# EAGLE design epiano (EAGLE 9.6.1)
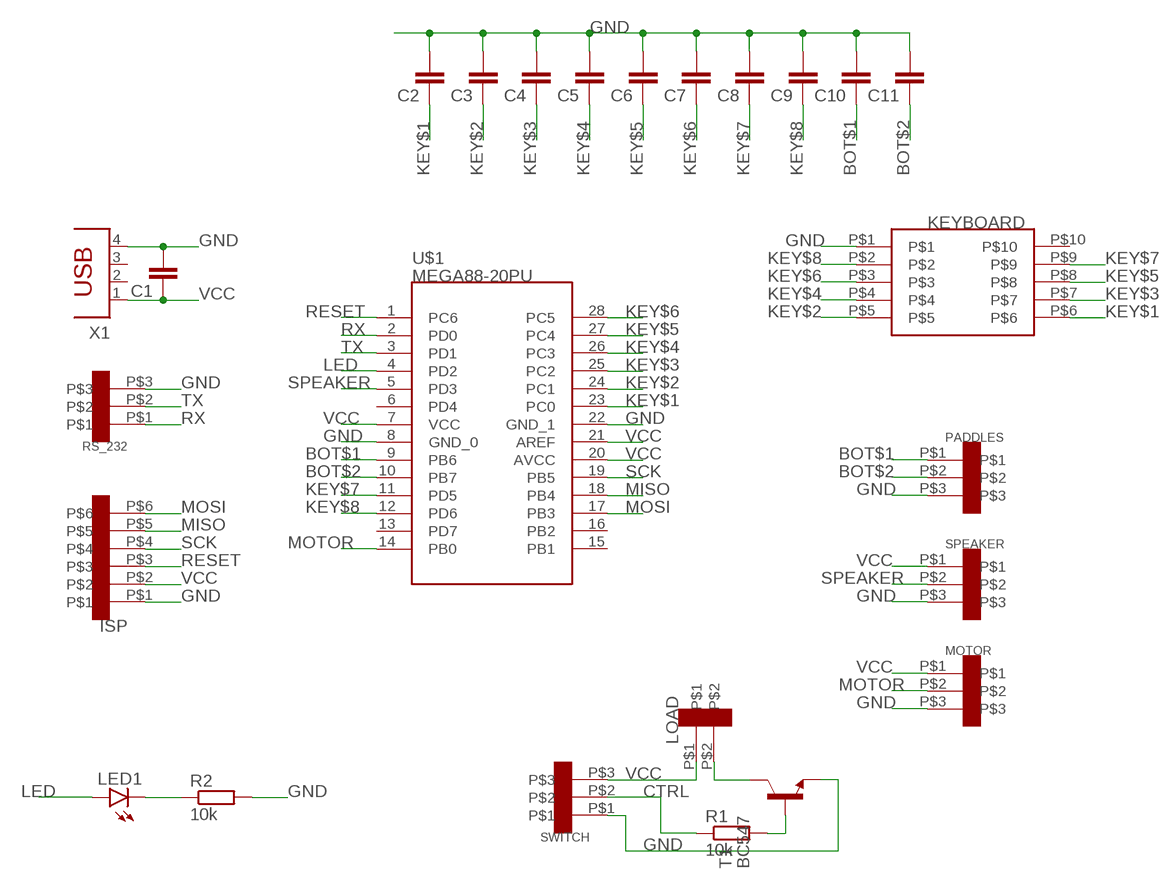
[diagram p0: schematic, sheet 1]

## Parts
C1  C-EU025-060X050  [C025-060X050]
C2  C-EU025-024X044  [C025-024X044]
C3  C-EU025-024X044  [C025-024X044]
C4  C-EU025-024X044  [C025-024X044]
C5  C-EU025-024X044  [C025-024X044]
C6  C-EU025-024X044  [C025-024X044]
C7  C-EU025-024X044  [C025-024X044]
C8  C-EU025-024X044  [C025-024X044]
C9  C-EU025-024X044  [C025-024X044]
C10  C-EU025-024X044  [C025-024X044]
C11  C-EU025-024X044  [C025-024X044]
ISP  CON_DIL_6  [CON_DIL_6]
KEYBOARD  CON_DIL_2X5  [CON_DIL_2X5]
LED1  LED3MM  [LED3MM]
LOAD  CON_DIL_2  [CON_DIL_2]
MOTOR  CON_DIL_3  [CON_DIL_3]
PADDLES  CON_DIL_3  [CON_DIL_3]
R1  10k  R-EU_0204/5  [0204/5]
R2  10k  R-EU_0207/15  [0207/15]
RS_232  CON_DIL_3  [CON_DIL_3]
SPEAKER  CON_DIL_3  [CON_DIL_3]
SWITCH  CON_DIL_3  [CON_DIL_3]
T1  BC547  [TO92]
U$1  MEGA88-20PU  [DIL28-3]
X1  PN87520  [PN87520]

## Nets
BOT$1: C10.1 PADDLES.P$1 U$1.9(PB6)
BOT$2: C11.1 PADDLES.P$2 U$1.10(PB7)
CTRL: R1.1 SWITCH.P$2
GND: C1.2 C2.2 C3.2 C4.2 C5.2 C6.2 C7.2 C8.2 C9.2 C10.2 C11.2 ISP.P$1 KEYBOARD.P$1 MOTOR.P$3 PADDLES.P$3 R2.2 RS_232.P$3 SPEAKER.P$3 SWITCH.P$1 T1.1(E) U$1.8(GND_0) U$1.22(GND_1) X1.4
KEY$1: C2.1 KEYBOARD.P$6 U$1.23(PC0)
KEY$2: C3.1 KEYBOARD.P$5 U$1.24(PC1)
KEY$3: C4.1 KEYBOARD.P$7 U$1.25(PC2)
KEY$4: C5.1 KEYBOARD.P$4 U$1.26(PC3)
KEY$5: C6.1 KEYBOARD.P$8 U$1.27(PC4)
KEY$6: C7.1 KEYBOARD.P$3 U$1.28(PC5)
KEY$7: C8.1 KEYBOARD.P$9 U$1.11(PD5)
KEY$8: C9.1 KEYBOARD.P$2 U$1.12(PD6)
LED: LED1.A U$1.4(PD2)
MISO: ISP.P$5 U$1.18(PB4)
MOSI: ISP.P$6 U$1.17(PB3)
MOTOR: MOTOR.P$2 U$1.14(PB0)
N$1: R1.2 T1.2(B)
N$2: LOAD.P$2 T1.3(C)
N$3: LED1.K(C) R2.1
RESET: ISP.P$3 U$1.1(PC6)
RX: RS_232.P$1 U$1.2(PD0)
SCK: ISP.P$4 U$1.19(PB5)
SPEAKER: SPEAKER.P$2 U$1.5(PD3)
TX: RS_232.P$2 U$1.3(PD1)
VCC: C1.1 ISP.P$2 LOAD.P$1 MOTOR.P$1 SPEAKER.P$1 SWITCH.P$3 U$1.7(VCC) U$1.20(AVCC) U$1.21(AREF) X1.1
Unconnected: KEYBOARD.P$10 U$1.6(PD4) U$1.13(PD7) U$1.15(PB1) U$1.16(PB2) X1.2 X1.3

## Library data of the parts
C1-C11 = rcl:C-EU: CAPACITOR, European symbol
ISP = m_connector:CON_DIL_6
KEYBOARD = connector:CON_DIL_2X5
LED1 = led:LED: LED OSRAM: - CHIPLED LG R971, LG N971, LY N971, LG Q971, LY Q971, LO R971, LY R971 LH N974, LH R974 LS Q976, LO Q976, LY Q976 LO Q996 - Hyper CHIPLED LW Q18S LB Q993, LB Q99A, LB R99A - SideLED LS A670, LO A670, LY A670, LG A670, LP A670 LB A673, LV A673, LT A673, LW A673 LH A674 LY A675 LS A676, LA A676, LO A676, LY A676, LW A676 LS A679, LY A679, LG A679 - Hyper Micro SIDELED® LS Y876, LA Y876, LO Y876, LY Y876 LT Y87S - SmartLED LW L88C, LW L88S LB L89C, LB L89S, LG L890 LS L89K, LO L89K, LY L89K LS L896, LA L896, LO L896, LY L896 - TOPLED LS T670, LO T670, LY T670, LG T670, LP T670 LSG T670, LSP T670, LSY T670, LOP T670, LYG T670 LG T671, LOG T671, LSG T671 LB T673, LV T673, LT T673, LW T673 LH T674 LS T676, LA T676, LO T676, LY T676, LB T676, LH T676, LSB T676, LW T676 LB T67C, LV T67C, LT T67C, LS T67K, LO T67K, LY T67K, LW E67C LS E67B, LA E67B, LO E67B, LY E67B, LB E67C, LV E67C, LT E67C LW T67C LS T679, LY T679, LG T679 LS T770, LO T770, LY T770, LG T770, LP T770 LB T773, LV T773, LT T773, LW T773 LH T774 LS E675, LA E675, LY E675, LS T675 LS T776, LA T776, LO T776, LY T776, LB T776 LHGB T686 LT T68C, LB T68C - Hyper Mini TOPLED® LB M676 - Mini TOPLED Santana® LG M470 LS M47K, LO M47K, LY M47K Source: http://www.osram.convergy.de LUXEON: - LUMILED® LXK2-PW12-R00, LXK2-PW12-S00, LXK2-PW14-U00, LXK2-PW14-V00 LXK2-PM12-R00, LXK2-PM12-S00, LXK2-PM14-U00 LXK2-PE12-Q00, LXK2-PE12-R00, LXK2-PE12-S00, LXK2-PE14-T00, LXK2-PE14-U00 LXK2-PB12-K00, LXK2-PB12-L00, LXK2-PB12-M00, LXK2-PB14-N00, LXK2-PB14-P00, LXK2-PB14-Q00 LXK2-PR12-L00, LXK2-PR12-M00, LXK2-PR14-Q00, LXK2-PR14-R00 LXK2-PD12-Q00, LXK2-PD12-R00, LXK2-PD12-S00 LXK2-PH12-R00, LXK2-PH12-S00 LXK2-PL12-P00, LXK2-PL12-Q00, LXK2-PL12-R00 Source: www.luxeon.com KINGBRIGHT: KA-3528ASYC Source: www.kingbright.com
LOAD = connector:CON_DIL_2
MOTOR PADDLES RS_232 SPEAKER SWITCH = m_connector:CON_DIL_3
R1 R2 = rcl-2:R-EU_: RESISTOR, European symbol
T1 = transistor:BC547: NPN TRANSISTOR
U$1 = m_atmel:MEGA88-20PU
X1 = con-berg:PN87520: BERG USB connector; OC_FARNELL: unknown; OC_NEWARK: unknown

## Board
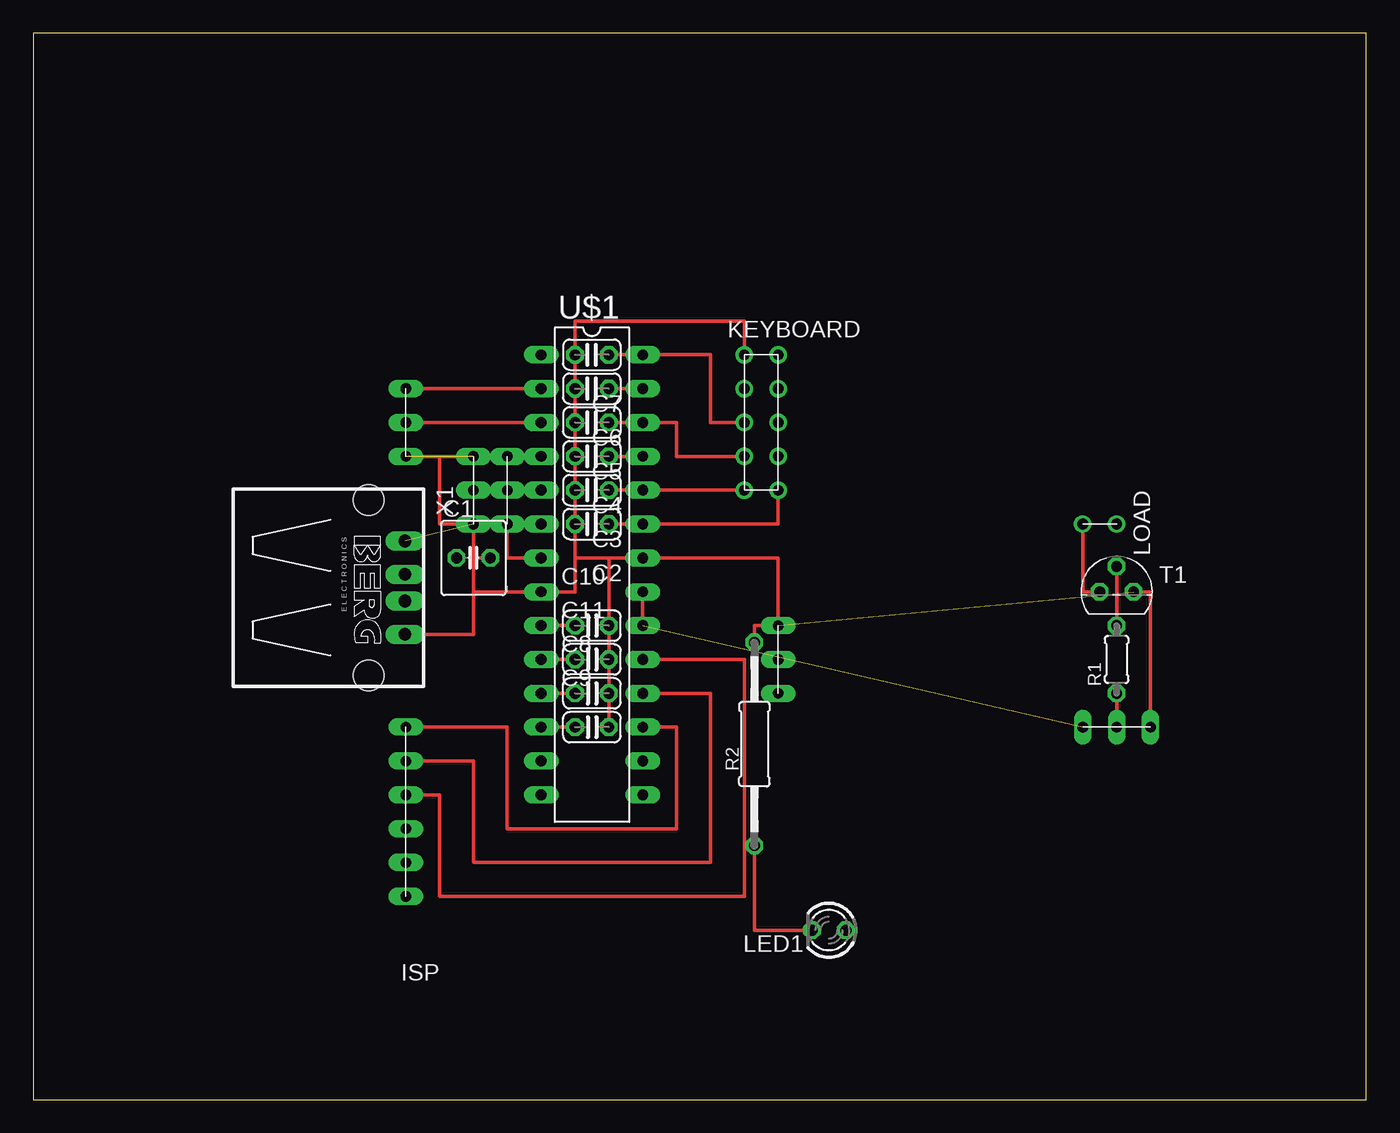
[diagram p1: board, top side]
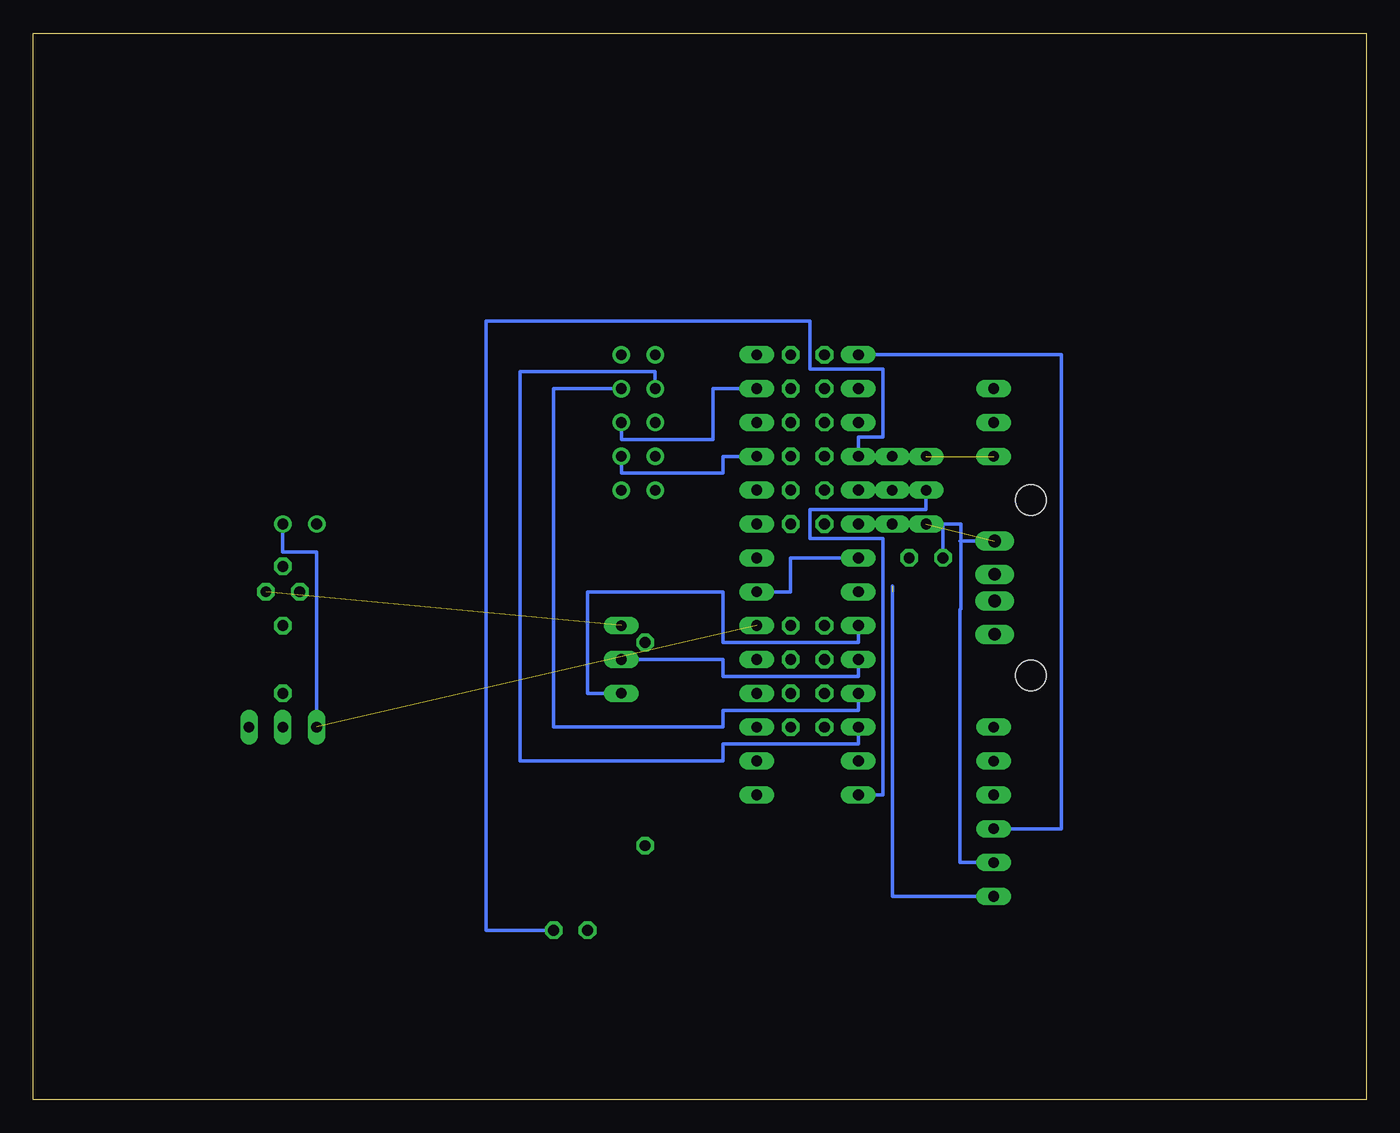
[diagram p2: board, bottom side, seen from below]

Size 100 x 80 mm. Coordinates in mm from the lower left corner, seen from the top.
Outline: 0,0 100,0 100,80 0,80 0,0
Copper layers (1*16): Top 0.035mm / dielectric 1.5mm / Bottom 0.035mm
Design rules "default": minimum track width 10mil, minimum drill 24mil, track to track 8mil, track to pad 8mil, pad to pad 8mil, via to via 8mil, smd to smd 8mil, copper to edge 40mil, drill to drill 8mil, minimum pad ring 10mil, minimum via ring 8mil, stop-mask expansion 4mil, vias tented up to drill 0mil, thermal gap 10mil

### Footprints (pad centres in the part's own frame; a part is rotated, then mirrored left to right if it is on the bottom)
C025-060X050 = drill 0.813 octagon: 1 -1.27,0; 2 1.27,0
C025-024X044 = drill 0.813 octagon: 1 -1.27,0; 2 1.27,0
CON_DIL_6 = drill 0.8 long: P$1 -2.54,5.08; P$2 -2.54,2.54; P$3 -2.54,0; P$4 -2.54,-2.54; P$5 -2.54,-5.08; P$6 -2.54,-7.62
CON_DIL_2X5 = drill 0.8: P$1 -1.27,5.08; P$2 -1.27,2.54; P$3 -1.27,0; P$4 -1.27,-2.54; P$5 -1.27,-5.08; P$6 1.27,-5.08; P$7 1.27,-2.54; P$8 1.27,0; P$9 1.27,2.54; P$10 1.27,5.08
LED3MM = drill 0.813 octagon: A -1.27,0; K 1.27,0
CON_DIL_2 = drill 0.8: P$1 0,2.54; P$2 0,0
CON_DIL_3 = drill 0.8 long: P$1 0,2.54; P$2 0,0; P$3 0,-2.54
0204/5 = drill 0.813 octagon: 1 -2.54,0; 2 2.54,0
0207/15 = drill 0.813 octagon: 1 -7.62,0; 2 7.62,0
TO92 = drill 0.813 octagon: 1 1.27,0; 2 0,1.905; 3 -1.27,0
DIL28-3 = drill 0.813 long: 1 -16.51,-3.81; 2 -13.97,-3.81; 3 -11.43,-3.81; 4 -8.89,-3.81; 5 -6.35,-3.81; 6 -3.81,-3.81; 7 -1.27,-3.81; 8 1.27,-3.81; 9 3.81,-3.81; 10 6.35,-3.81; 11 8.89,-3.81; 12 11.43,-3.81; 13 13.97,-3.81; 14 16.51,-3.81; 15 16.51,3.81; 16 13.97,3.81; 17 11.43,3.81; 18 8.89,3.81; 19 6.35,3.81; 20 3.81,3.81; 21 1.27,3.81; 22 -1.27,3.81; 23 -3.81,3.81; 24 -6.35,3.81; 25 -8.89,3.81; 26 -11.43,3.81; 27 -13.97,3.81; 28 -16.51,3.81
PN87520 = drill 0.95 long: 1 -3.5,2.71; 2 -1,2.71; 3 1,2.71; 4 3.5,2.71 | hole 2.3: -6.57,0; 6.57,0

### Placement (x,y rotation side)
C1  33.02,40.64 0 top
C2  41.91,43.18 180 top
C3  41.91,45.72 180 top
C4  41.91,48.26 180 top
C5  41.91,50.8 180 top
C6  41.91,53.34 180 top
C7  41.91,55.88 180 top
C8  41.91,30.48 0 top
C9  41.91,27.94 0 top
C10  41.91,35.56 0 top
C11  41.91,33.02 0 top
ISP  25.4,20.32 180 top
KEYBOARD  54.61,50.8 0 top
LED1  59.69,12.7 180 top
LOAD  78.74,43.18 270 top
MOTOR  33.02,45.72 180 top
PADDLES  55.88,33.02 180 top
R1  81.28,33.02 90 top
R2  54.1,26.67 90 top
RS_232  27.94,50.8 0 top
SPEAKER  35.56,45.72 180 top
SWITCH  81.28,27.94 270 top
T1  81.28,38.1 0 top
U$1  41.91,39.37 270 top
X1  25.17,38.4 270 top

### Tracks (layer width: path | path; a pad name or v marks a point on that pad's centre or on a via)
BOT$1
  Top 0.254: C10.1 U$1.9
  Bottom 0.254: PADDLES.P$1 58.42,30.48 58.42,38.1 48.26,38.1 48.26,34.29 38.1,34.29 U$1.9
BOT$2
  Top 0.254: C11.1 U$1.10
  Bottom 0.254: PADDLES.P$2 48.26,33.02 48.26,31.75 38.1,31.75 U$1.10
CTRL
  Top 0.254: SWITCH.P$2 R1.1
GND  (3 unrouted)
  Top 0.254: C5.2 C3.2 | C3.2 C2.2 40.64,40.64 | 40.64,40.64 43.18,40.64 | 43.18,40.64 U$1.22 55.88,40.64 PADDLES.P$3 54.1,35.56 R2.2 | 40.64,40.64 40.64,38.1 U$1.8 | C9.2 C8.2 C11.2 C10.2 43.18,40.64 | RS_232.P$3 30.48,48.26 | 30.48,48.26 30.48,43.18 33.02,43.18 33.02,40.64 | 33.02,40.64 33.02,38.1 | U$1.8 33.02,38.1 | KEYBOARD.P$1 53.34,58.42 40.64,58.42 C7.2 C6.2 C5.2 | X1.4 33.02,34.91 33.02,38.1 | 35.56,38.1 U$1.8 | C5.2 C4.2 C3.2 | C1.2 33.02,40.64 | SPEAKER.P$3 30.48,48.26 | T1.1 83.82,38.1 SWITCH.P$1
  Bottom 0.254: ISP.P$1 35.56,15.24 35.56,38.52
KEY$1
  Top 0.254: C2.1 U$1.23 55.88,43.18 KEYBOARD.P$6
KEY$2
  Top 0.254: C3.1 U$1.24 KEYBOARD.P$5
KEY$3
  Top 0.254: C4.1 U$1.25
  Bottom 0.254: KEYBOARD.P$7 55.88,46.99 48.26,46.99 48.26,48.26 U$1.25
KEY$4
  Top 0.254: C5.1 U$1.26 48.26,50.8 48.26,48.26 KEYBOARD.P$4
KEY$5
  Top 0.254: C6.1 U$1.27
  Bottom 0.254: U$1.27 49.02,53.34 49.02,49.53 55.88,49.53 KEYBOARD.P$8
KEY$6
  Top 0.254: C7.1 U$1.28 50.8,55.88 50.8,50.8 KEYBOARD.P$3
KEY$7
  Top 0.254: C8.1 U$1.11
  Bottom 0.254: KEYBOARD.P$9 60.96,53.34 60.96,27.94 48.26,27.94 48.26,29.21 40.64,29.21 39.37,29.21 38.1,29.21 U$1.11
KEY$8
  Top 0.254: C9.1 U$1.12
  Bottom 0.254: KEYBOARD.P$2 53.34,54.61 63.5,54.61 63.5,25.4 48.26,25.4 48.26,26.67 38.1,26.67 U$1.12
LED
  Bottom 0.254: U$1.4 38.1,49.71 36.25,49.71 36.25,54.79 41.73,54.79 41.73,58.42 66.04,58.42 66.04,12.7 LED1.A
MISO
  Top 0.254: U$1.18 50.8,30.48 50.8,17.78 33.02,17.78 33.02,25.4 ISP.P$5
MOSI
  Top 0.254: U$1.17 48.26,27.94 48.26,20.32 35.56,20.32 35.56,27.94 ISP.P$6
MOTOR
  Bottom 0.254: MOTOR.P$2 33.02,44.27 41.73,44.27 41.73,42.09 36.25,42.09 36.25,22.86 U$1.14
N$1
  Top 0.254: R1.2 T1.2
N$2
  Top 0.254: T1.3 78.74,38.1 LOAD.P$2
N$3
  Top 0.254: R2.1 54.1,12.7 LED1.K
RESET
  Bottom 0.254: U$1.1 22.86,55.88 22.86,20.32 ISP.P$3
RX
  Top 0.254: U$1.2 RS_232.P$1
SCK
  Top 0.254: U$1.19 53.34,33.02 53.34,15.24 30.48,15.24 30.48,22.86 ISP.P$4
SPEAKER
  Top 0.254: U$1.5 SPEAKER.P$2
TX
  Top 0.254: RS_232.P$2 U$1.3
VCC  (2 unrouted)
  Top 0.254: U$1.20 U$1.21 | SPEAKER.P$1 35.56,40.64 U$1.7
  Bottom 0.254: X1.1 30.42,41.91 | ISP.P$2 30.48,17.78 30.48,36.77 30.42,36.83 30.42,41.91 | U$1.7 43.18,40.64 43.18,38.1 U$1.21 | 30.48,41.91 30.42,41.91 | C1.1 31.75,43.18 | 31.75,43.18 SPEAKER.P$1 | 30.42,41.91 30.42,43.18 31.75,43.18 | LOAD.P$1 81.28,41.1 78.74,41.1 SWITCH.P$3